# EAGLE design piezo-preamp-tickler-buffer-only-V0 (EAGLE 7.5.0)
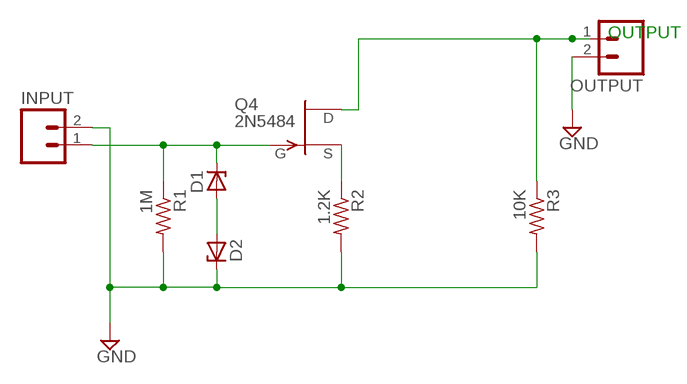
[diagram p0: schematic, sheet 1]

## Parts
D1  1N821  [DO35Z10]
D2  1N821  [DO35Z10]
INPUT  M02LOCK  [1X02_LOCK]
OUTPUT  M02LOCK  [1X02_LOCK]
Q4  2N5484  [TO92-]
R1  1M  R-US_VMTA55  [VMTA55]
R2  1.2K  R-US_VMTA55  [VMTA55]
R3  10K  R-US_VMTA55  [VMTA55]

## Nets
GND: D2.C INPUT.2 OUTPUT.2 R1.2 R2.2 R3.2
JFET-GATE: D1.C INPUT.1 Q4.1(G) R1.1
N$1: D1.A D2.A
N$2: OUTPUT.1 Q4.3(D) R3.1
N$3: Q4.2(S) R2.1

## Notes on the sheet
- OUTPUT

## Library data of the parts
D1 D2 = diode:1N821: Reference DIODE temperature compensated, 6,2 V
INPUT OUTPUT = CMU-ArtFab:M02: Header 2 Standard 2-pin 0.1" header. Use with straight break away headers (SKU : PRT-00116), right angle break away headers (PRT-00553), swiss pins (PRT-00743), machine pins (PRT-00117), and female headers (PRT-00115). Molex polarized connector foot print use with SKU : PRT-08233 with associated crimp pins and housings.
Q4 = transistor-fet:?548*: N-Channel JFETs Source: VISHAY 2N5484.pdf Compatible: TO92 2N5245 J304 J305 U310 J308 J309 J310 TO72 2N4416 2N4416A 2N3823 2N4351 3N169 3N170 3N171 MFE3002 TO18 2N3796 2N3797 MFE825 Source: Motorola European Master Guide Pacge 3-59
R1-R3 = resistor:R-US_: RESISTOR, American symbol

## Net classes
0 default: width 0.6 mm, clearance 0.1 mm

## Board
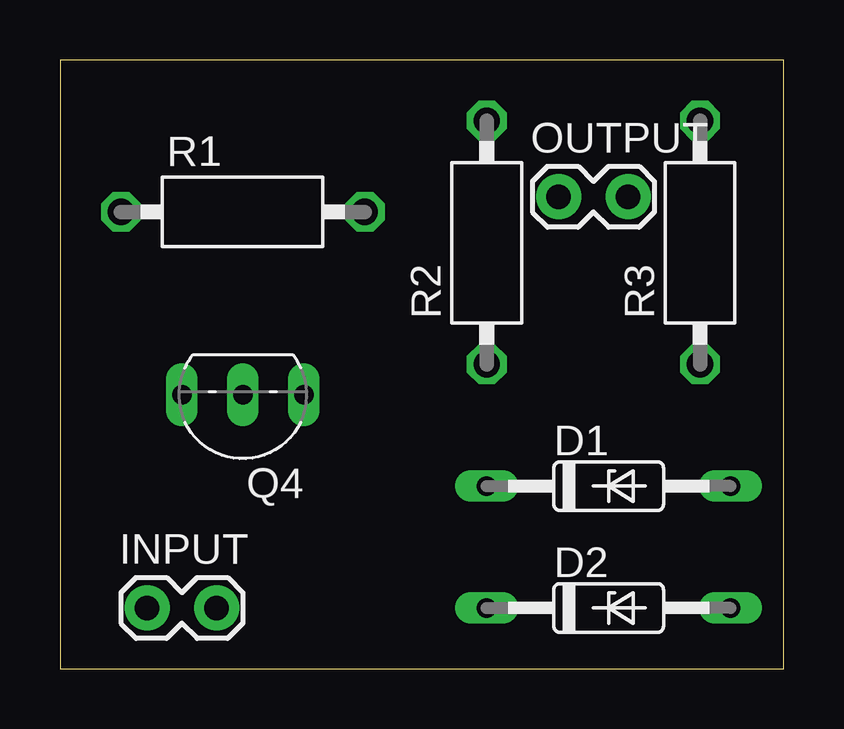
[diagram p1: board, top side]
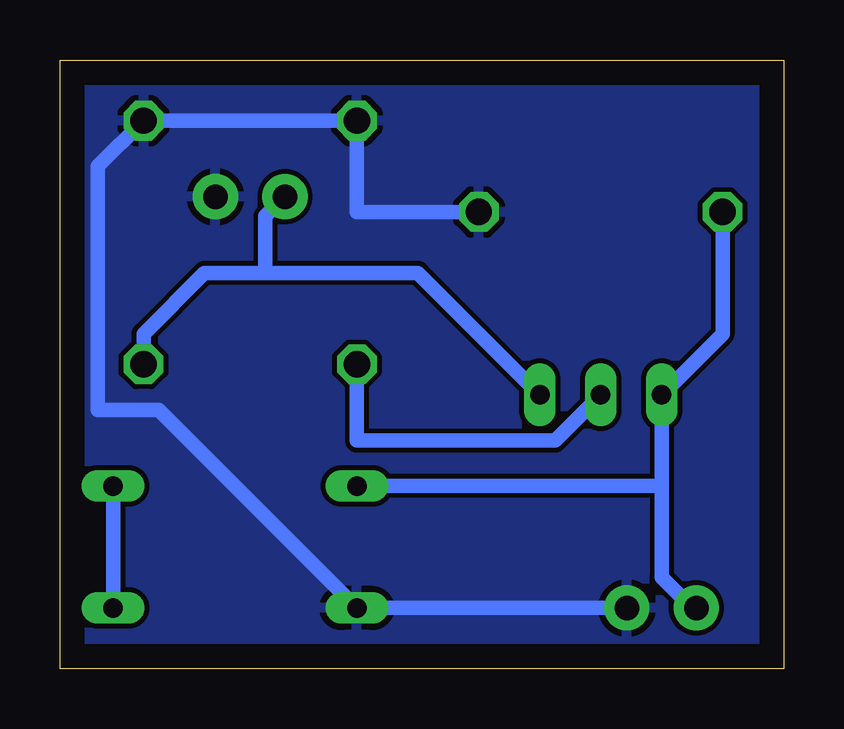
[diagram p2: board, bottom side, seen from below]

Size 30.15 x 25.39 mm. Coordinates in mm from the lower left corner, seen from the top.
Outline: 0,0 30.15,0 30.15,25.39 0,25.39 0,0
Copper layers (1*16): Top 0.035mm / dielectric 1.5mm / Bottom 0.035mm
Design rules "default": minimum track width 10mil, minimum drill 24mil, track to track 8mil, track to pad 8mil, pad to pad 8mil, via to via 8mil, smd to smd 8mil, copper to edge 40mil, drill to drill 8mil, minimum pad ring 10mil, minimum via ring 8mil, stop-mask expansion 4mil, vias tented up to drill 0mil, thermal gap 10mil

### Footprints (pad centres in the part's own frame; a part is rotated, then mirrored left to right if it is on the bottom)
DO35Z10 = drill 0.813 long: A 5.08,0; C -5.08,0
1X02_LOCK = drill 1.016 pad 1.88: 1 -0.178,0; 2 2.718,0
TO92- = drill 0.813 long: 1 2.54,0; 2 0,0; 3 -2.54,0
VMTA55 = drill 1.1 octagon: 1 -5.08,0; 2 5.08,0

### Placement (x,y rotation side)
D1  22.86,7.62 0 top
D2  22.86,2.54 0 top
INPUT  3.81,2.54 0 top
OUTPUT  20.95,19.68 0 top
Q4  7.62,11.43 180 top
R1  7.62,19.05 0 top
R2  17.78,17.78 90 top
R3  26.67,17.78 90 top

### Tracks (layer width: path | path; a pad name or v marks a point on that pad's centre or on a via)
GND
  Bottom 0.6: INPUT.2 D2.C 26.04,10.79 28.57,10.79 28.57,20.95 R3.2 R2.2 17.78,19.05 R1.2
  pour Bottom: 0,25.4 30.48,25.4 30.48,0 0,0
JFET-GATE
  Bottom 0.6: R1.1 2.54,13.97 Q4.1 5.08,7.62 | 5.08,7.62 D1.C | 5.08,7.62 5.08,3.81 3.81,2.54 INPUT.1
N$1
  Bottom 0.6: D1.A D2.A
N$2
  Bottom 0.6: Q4.3 15.24,16.51 21.59,16.51 | 21.59,16.51 24.13,16.51 26.67,13.97 R3.1 | OUTPUT.1 21.59,18.87 21.59,16.51
N$3
  Bottom 0.6: Q4.2 9.53,9.53 17.78,9.53 R2.1